# EAGLE design DS18B20_with_DS2480B_MAX233_V4 (EAGLE 7.5.0)
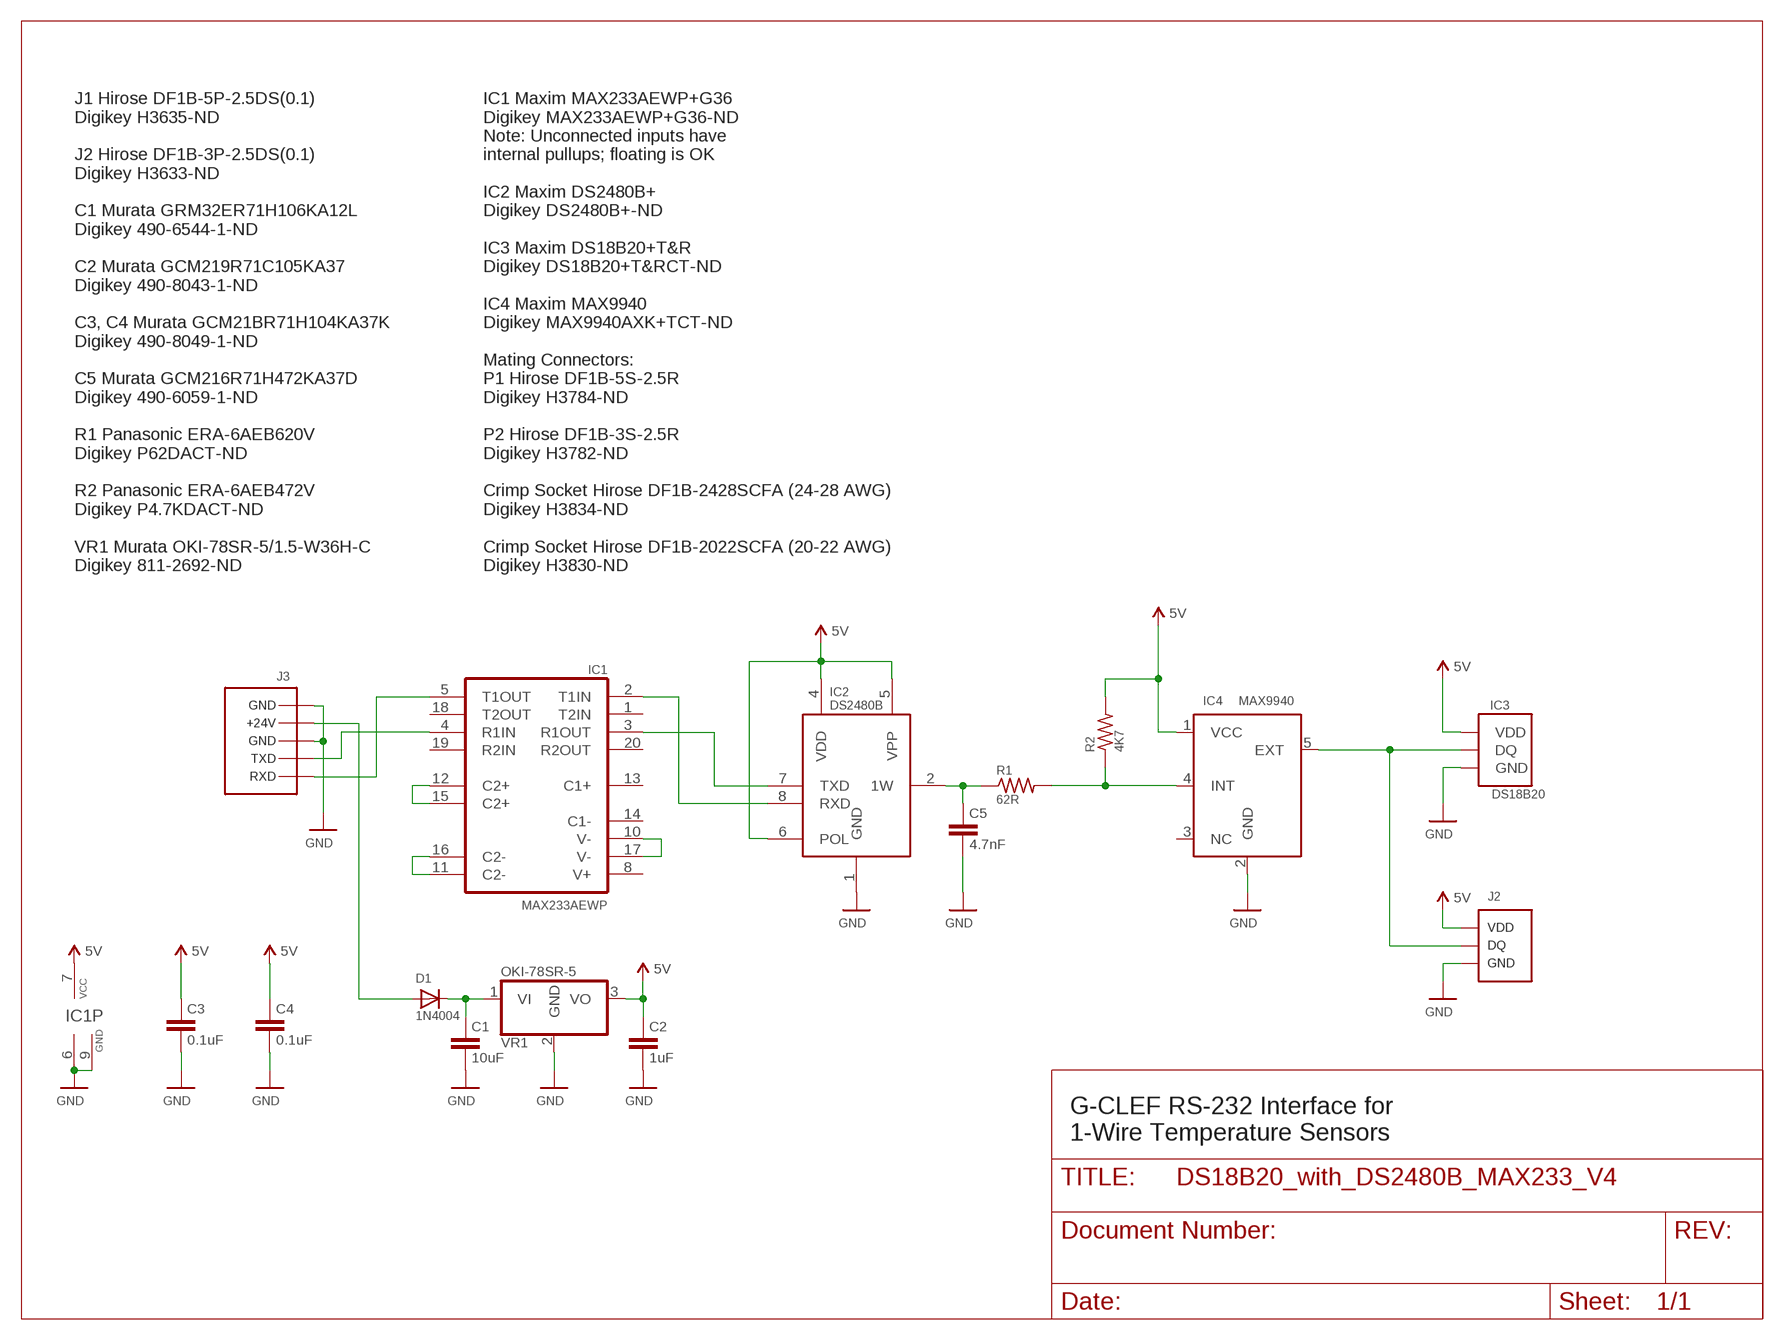
[diagram p0: schematic, sheet 1]

## Parts
C1  10uF  C-UNPOL1210-CAP  [CAPC3225X270N]
C2  1uF  C-UNPOL0805-CAP  [CAPC2013X135N]
C3  0.1uF  C-UNPOL0805-CAP  [CAPC2013X135N]
C4  0.1uF  C-UNPOL0805-CAP  [CAPC2013X135N]
C5  4.7nF  C-UNPOL0805-CAP  [CAPC2013X135N]
D1  1N4004  [DO41-10]
IC1  MAX233AEWP  [SO20L]
IC2  DS2480B  [SO08]
IC3  DS18B20  [TO92-]
IC4  MAX9940  [SC70-5L]
J2  DF1B-3P  [DF1B-3P]
J3  DF1B-5P  [DF1B-5P]
R1  62R  RESISTOR-0805  [RESISTOR-0805]
R2  4K7  RESISTOR-0805  [RESISTOR-0805]
VR1  OKI-78SR-5  OKI-78SRH  [OKI-78SR]

## Nets
5V: C2.1 C3.1 C4.1 IC1.7(VCC) IC2.4(VDD) IC2.5(VPP) IC2.6(POL) IC3.3(VDD) IC4.1(VCC) J2.P$3 R2.2 VR1.3(VO)
GND: C1.2 C2.2 C3.2 C4.2 C5.2 IC1.6(GND) IC1.9(GND) IC2.1(GND) IC3.1(GND) IC4.2(GND) J2.P$1 J3.P$3 J3.P$5 VR1.2(GND)
N$1: D1.A J3.P$4
N$2: C1.1 D1.C VR1.1(VI)
N$3: IC1.2(T1IN) IC2.8(RXD)
N$4: IC1.5(T1OUT) J3.P$1
N$5: IC1.4(R1IN) J3.P$2
N$7: IC1.12(C2+) IC1.15(C2+)
N$8: IC1.11(C2-) IC1.16(C2-)
N$9: IC1.10(V-) IC1.17(V-)
N$10: IC1.3(R1OUT) IC2.7(TXD)
N$11: C5.1 IC2.2(1W) R1.1
N$13: IC4.4(INT) R1.2 R2.1
N$14: IC3.2(DQ) IC4.5(EXT) J2.P$2
Unconnected: IC1.1(T2IN) IC1.8(V+) IC1.13(C1+) IC1.14(C1-) IC1.18(T2OUT) IC1.19(R2IN) IC1.20(R2OUT) IC4.3(NC)

## Notes on the sheet
- J1 Hirose DF1B-5P-2.5DS(0.1)
  Digikey H3635-ND
  
  J2 Hirose DF1B-3P-2.5DS(0.1)
  Digikey H3633-ND
  
  C1 Murata GRM32ER71H106KA12L
  Digikey 490-6544-1-ND
  
  C2 Murata GCM219R71C105KA37
  Digikey 490-8043-1-ND
  
  C3, C4 Murata GCM21BR71H104KA37K
  Digikey 490-8049-1-ND
  
  C5 Murata GCM216R71H472KA37D
  Digikey 490-6059-1-ND
  
  R1 Panasonic ERA-6AEB620V
  Digikey P62DACT-ND
  
  R2 Panasonic ERA-6AEB472V
  Digikey P4.7KDACT-ND
  
  VR1 Murata OKI-78SR-5/1.5-W36H-C
  Digikey 811-2692-ND
- IC1 Maxim MAX233AEWP+G36
  Digikey MAX233AEWP+G36-ND
  Note: Unconnected inputs have
  internal pullups; floating is OK
  
  IC2 Maxim DS2480B+
  Digikey DS2480B+-ND
  
  IC3 Maxim DS18B20+T&R
  Digikey DS18B20+T&RCT-ND
  
  IC4 Maxim MAX9940
  Digikey MAX9940AXK+TCT-ND
  
  Mating Connectors:
  P1 Hirose DF1B-5S-2.5R
  Digikey H3784-ND
  
  P2 Hirose DF1B-3S-2.5R
  Digikey H3782-ND
  
  Crimp Socket Hirose DF1B-2428SCFA (24-28 AWG)
  Digikey H3834-ND
  
  Crimp Socket Hirose DF1B-2022SCFA (20-22 AWG)
  Digikey H3830-ND
- GND
- +24V
- GND
- TXD
- RXD
- VDD
- DQ
- GND
- G-CLEF RS-232 Interface for
  1-Wire Temperature Sensors

## Library data of the parts
C1-C5 = AU2016:C-UNPOL
D1 = AU2016:1N4004: DIODE General purpose 1N400x type rectifier (With bigger pads) http://www.ladyada.net/library/pcb/eaglelibrary.html
IC1 = AU2016:MAX233AEWP: RS232 TRANSCEIVER; MPN: MAX233AEWP+G36; OC_FARNELL: unknown; OC_NEWARK: 89K3461
IC2 = AU2016:DS2480B: RS232 to 1-Wire Host Adapter/Line Driver with Load Sensor This device is a onewire host and UART interface in one chip. It provides the complete DC/AC requirements for onewire communication, including overdrive speed mode and 12V EPROM programming. On the UART side, it can operate at 9.6kBaud (default), 19.2kBaud, 57.6kBaud, and 115.2kBaud. The RxD and TxD lines are operated at 0V/5V. The POL pin selects the RxD and TxD "polarity", that means straight-through or inverted. If POL is connected to GND, RxD and TxD behave properly for connection to inverted RS232 drivers, like the MC1488/1489 or MAX23x chips. If POL is connected to Vdd, RxD and TxD behave properly for direct connection to a 0V/5V UART chip. Important Notes: RxD and TxD are seen from the UART point of view, that means the DS2480B TxD pin is really an input and the DS2480B RxD pin is really an output. Vpp must be connected to 5V/Vdd if EPROM programming is not required. Vdd must be always lower than or equal to Vpp, otherwise the chip will be damaged. Best idea is to provide a separate 12V->5V/5mA voltage regulator from Vpp to Vdd if EPROM programming is required. Author: Jan Kandziora <jjj@gmx.de>
IC3 = AU2016:DS18B20
IC4 = AU2016:MAX9940
J2 = AU2016:DF1B-3P
J3 = AU2016:DF1B-5P
R1 R2 = AU2016:RESISTOR-0805
VR1 = AU2016:OKI-78SR

## Board
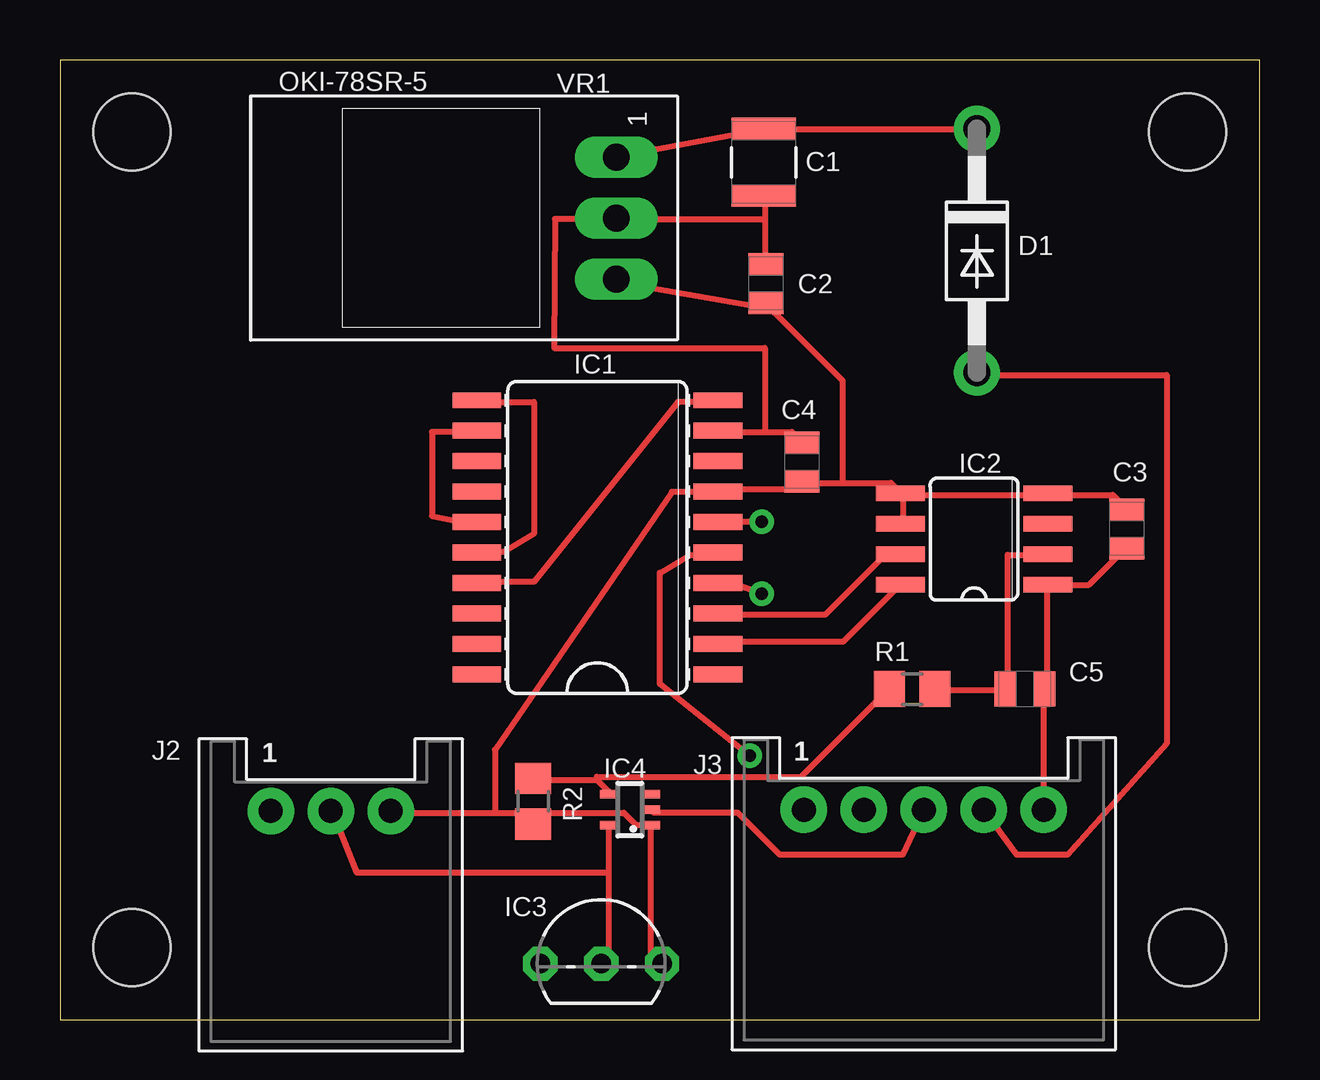
[diagram p1: board, top side]
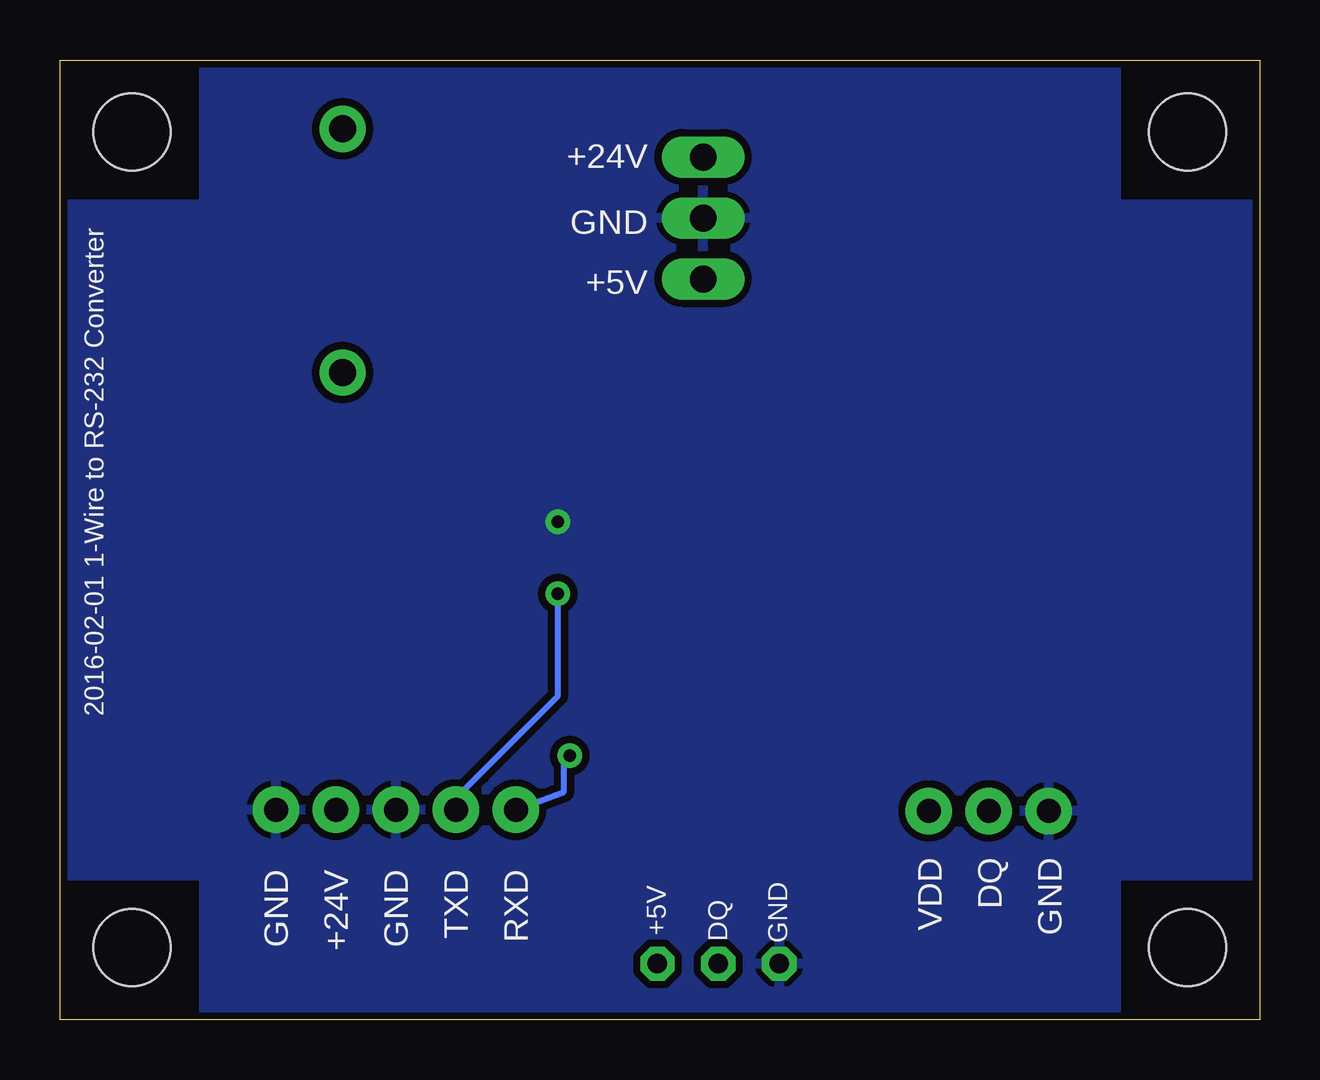
[diagram p2: board, bottom side, seen from below]

Size 50 x 40 mm. Coordinates in mm from the lower left corner, seen from the top.
Outline: 50,0 50,40 0,40 0,0 50,0
Copper layers (1*16): Top 0.035mm / dielectric 1.5mm / Bottom 0.035mm
Design rules "AU2016 *": minimum track width 10mil, minimum drill 20mil, track to track 8mil, track to pad 8mil, pad to pad 8mil, via to via 8mil, smd to smd 8mil, copper to edge 10mil, drill to drill 8mil, minimum pad ring 12mil, minimum via ring 10mil, stop-mask expansion 4mil, vias tented up to drill 25mil, thermal gap 10mil
Holes 3.2 mm at 47,3 3,3 3,37 47,37

### Footprints (pad centres in the part's own frame; a part is rotated, then mirrored left to right if it is on the bottom)
CAPC3225X270N = smd 0.914 x 2.692: 1 -1.397,0; 2 1.397,0
CAPC2013X135N = smd 0.914 x 1.448: 1 -0.813,0; 2 0.813,0
DO41-10 = drill 1.118 pad 1.93: A 5.08,0; C -5.08,0
SO20L = smd 0.66 x 2.032: 1 -5.715,-5.029; 2 -4.445,-5.029; 3 -3.175,-5.029; 4 -1.905,-5.029; 5 -0.635,-5.029; 6 0.635,-5.029; 7 1.905,-5.029; 8 3.175,-5.029; 9 4.445,-5.029; 10 5.715,-5.029; 11 5.715,5.029; 12 4.445,5.029; 13 3.175,5.029; 14 1.905,5.029; 15 0.635,5.029; 16 -0.635,5.029; 17 -1.905,5.029; 18 -3.175,5.029; 19 -4.445,5.029; 20 -5.715,5.029
SO08 = smd 0.66 x 2.032: 1 -1.905,-3.073; 2 -0.635,-3.073; 3 0.635,-3.073; 4 1.905,-3.073; 5 1.905,3.073; 6 0.635,3.073; 7 -0.635,3.073; 8 -1.905,3.073
TO92- = drill 0.813 octagon: 1 -2.54,0; 2 0,0; 3 2.54,0
SC70-5L = smd 0.35 x 0.8: 1 -0.65,-0.85; 2 0,-0.85; 3 0.65,-0.85; 4 0.65,0.85; 5 -0.65,0.85
DF1B-3P = drill 1 pad 1.93: P$1 2.5,-3.81; P$2 0,-3.81; P$3 -2.5,-3.81
DF1B-5P = drill 1 pad 1.93: P$1 5,0; P$2 2.5,0; P$3 0,0; P$4 -2.5,0; P$5 -5,0
RESISTOR-0805 = smd 1.3 x 1.5: 1 -0.95,0; 2 0.95,0
OKI-78SR = drill 1.118 long: 1 2.54,-10.16; 2 0,-10.16; 3 -2.54,-10.16

### Placement (x,y rotation side)
C1  29.33,35.73 270 top
C2  29.43,30.68 90 top
C3  44.47,20.45 270 top
C4  30.93,23.24 90 top
C5  40.21,13.78 0 top
D1  38.22,32.05 270 top
IC1  22.4,20.1 90 top
IC2  38.1,20.03 90 top
IC3  22.56,2.33 0 top
IC4  23.75,8.75 90 top
J2  11.29,4.88 180 top
J3  36,8.75 180 top
R1  35.52,13.78 180 top
R2  19.72,9.1 270 top
VR1  13.03,33.41 90 top

### Tracks (layer width: path | path; a pad name or v marks a point on that pad's centre or on a via)
5V
  Top 0.254: IC3.3 25,2.38 24.62,2.38 24.62,8 IC4.1 24.5,8.12 24,8.12 23.5,8.62 19.38,8.62 R2.2 19.62,8.25 19.25,8.62 18.12,8.62 | 18.12,8.62 13.88,8.62 J2.P$3 | VR1.3 23.25,30.75 29,29.75 29.38,29.88 C2.1 29.5,29.75 32.62,26.62 32.62,22.38 | C3.1 44.38,21.38 43.88,21.88 41.25,21.88 IC2.4 41.12,21.88 35.25,21.88 IC2.5 | IC2.6 35.12,20.75 35.12,21.88 IC2.5 | 32.62,22.38 31,22.38 C4.1 30.88,22.38 30.62,22.12 27.5,22.12 IC1.7 27.38,22 25.5,22 18.12,11.25 18.12,8.62 | 32.62,22.38 34.62,22.38 35,22 IC2.5
GND  (via drill 0.51)
  Top 0.254: C3.2 44.38,19.62 42.88,18.12 IC2.1 41.12,18.12 41.12,13.88 C5.2 41,13.75 J3.P$5 | 29.38,33.38 29.38,34.25 C1.2 | 29.38,33.38 29.38,31.5 C2.2 | 29.38,24.5 27.5,24.5 IC1.9 | 29.38,24.5 30.5,24.5 30.88,24.12 C4.2 | J3.P$3 35.12,6.88 30,6.88 28.25,8.62 24.75,8.62 24.62,8.75 IC4.2 | v29.25,20.75 27.5,20.75 IC1.6 | 29.38,24.5 29.38,28 20.6,28 20.62,33.38 23.12,33.38 VR1.2 23.25,33.38 29.38,33.38
  pour Bottom (isolate 0.305): 44,6 50,6 50,34 44,34 44,40 6,40 6,34 0,34 0,6 6,6 6,0 44,0
N$1
  Top 0.254: J3.P$4 39.88,6.88 42,6.88 46.12,11.5 46.12,26.88 38.25,26.88 D1.A
N$2
  Top 0.254: VR1.1 23.25,36 28.62,37 29.25,37.12 C1.1 29.38,37.12 38.12,37.12 D1.C
N$3
  Top 0.254: IC1.2 27.5,15.75 32.62,15.75 35,18.12 IC2.8
N$4  (via drill 0.51)
  Top 0.254: v28.75,11 25,14 25,18.62 26.25,19.38 27.38,19.38 IC1.5
  Bottom 0.254: J3.P$1 29,9.5 29,11 v28.75,11
N$5  (via drill 0.51)
  Top 0.254: v29.25,17.75 27.88,18.25 27.5,18.12 IC1.4
  Bottom 0.254: v29.25,17.75 29.25,13.5 33.5,9.25 J3.P$2
N$7
  Top 0.254: IC1.15 17.25,20.75 16.75,20.75 15.5,21 15.5,24.5 17.25,24.5 IC1.12
N$8
  Top 0.254: IC1.16 17.38,19.5 18.5,19.5 19.75,20.25 19.75,25.75 17.38,25.75 IC1.11
N$9
  Top 0.254: IC1.17 17.38,18.25 19.75,18.25 25.75,25.75 27.38,25.75 IC1.10
N$10
  Top 0.254: IC1.3 27.5,16.88 31.88,16.88 34.38,19.38 35,19.38 IC2.7
N$11
  Top 0.254: R1.1 36.5,13.75 39.38,13.75 C5.1 39.5,13.88 39.5,19.38 41.12,19.38 IC2.2
N$13
  Top 0.254: 22.38,10 22.88,9.5 IC4.4 | 22.38,10 19.75,10 R2.1 | R1.2 34.5,13.75 30.88,10.12 22.38,10.12 22.38,10
N$14
  Top 0.254: 22.88,6.12 22.88,2.38 22.62,2.38 IC3.2 | 22.88,6.12 22.88,8 IC4.5 | 22.88,6.12 12.38,6.12 11.38,8.62 J2.P$2

### Text on the board
bPlace: +24V | GND | 2016-02-01 1-Wire to RS-232 Converter | +5V | GND | DQ | VDD | GND | RXD | TXD | GND | +24V | GND | DQ | +5V